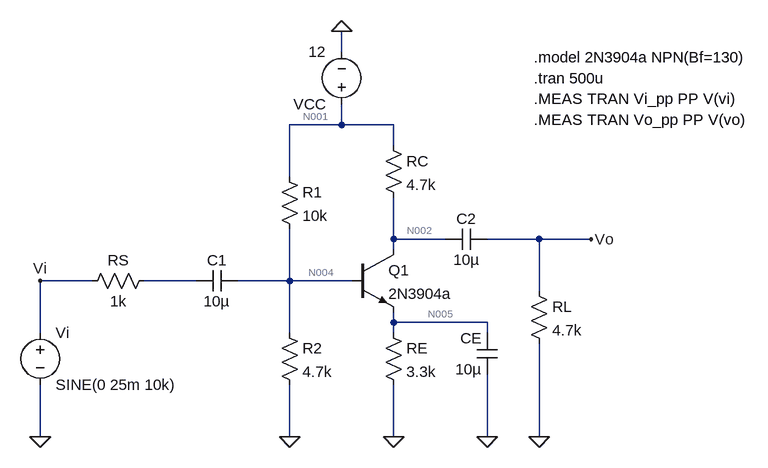
[diagram p0: schematic Circuito.asc]
Circuito.asc, the LTspice schematic file:
Version 4.1
SHEET 1 928 680
WIRE 272 -256 272 -288
WIRE 272 -144 272 -176
WIRE 272 -144 192 -144
WIRE 352 -144 272 -144
WIRE 352 -112 352 -144
WIRE 192 -64 192 -144
WIRE 352 32 352 -32
WIRE 432 32 352 32
WIRE 576 32 496 32
WIRE 656 32 576 32
WIRE 352 48 352 32
WIRE -112 96 -192 96
WIRE 48 96 -32 96
WIRE 192 96 192 16
WIRE 192 96 112 96
WIRE 288 96 192 96
WIRE 576 112 576 32
WIRE 352 160 352 144
WIRE 496 160 352 160
WIRE -192 176 -192 96
WIRE 192 176 192 96
WIRE 352 176 352 160
WIRE 496 176 496 160
WIRE -192 336 -192 256
WIRE 192 336 192 256
WIRE 352 336 352 256
WIRE 496 336 496 240
WIRE 576 336 576 192
FLAG -192 336 0
FLAG 192 336 0
FLAG 352 336 0
FLAG 496 336 0
FLAG 576 336 0
FLAG 272 -288 0
FLAG 656 32 Vo
FLAG -192 96 Vi
SYMBOL voltage 272 -160 R180
WINDOW 123 0 0 Left 0
WINDOW 39 0 0 Left 0
SYMATTR InstName VCC
SYMATTR Value 12
SYMBOL voltage -192 160 R0
WINDOW 123 0 0 Left 0
WINDOW 39 0 0 Left 0
SYMATTR InstName Vi
SYMATTR Value SINE(0 25m 10k)
SYMBOL res 176 -80 R0
SYMATTR InstName R1
SYMATTR Value 10k
SYMBOL res 176 160 R0
SYMATTR InstName R2
SYMATTR Value 4.7k
SYMBOL res 336 -128 R0
SYMATTR InstName RC
SYMATTR Value 4.7k
SYMBOL res 336 160 R0
SYMATTR InstName RE
SYMATTR Value 3.3k
SYMBOL res 560 96 R0
SYMATTR InstName RL
SYMATTR Value 4.7k
SYMBOL res -16 80 R90
WINDOW 0 0 56 VBottom 2
WINDOW 3 32 56 VTop 2
SYMATTR InstName RS
SYMATTR Value 1k
SYMBOL cap 112 80 R90
WINDOW 0 0 32 VBottom 2
WINDOW 3 32 32 VTop 2
SYMATTR InstName C1
SYMATTR Value 10µ
SYMBOL cap 512 240 R180
WINDOW 0 24 56 Left 2
WINDOW 3 24 8 Left 2
SYMATTR InstName CE
SYMATTR Value 10µ
SYMBOL cap 496 16 R90
WINDOW 0 0 32 VBottom 2
WINDOW 3 32 32 VTop 2
SYMATTR InstName C2
SYMATTR Value 10µ
SYMBOL npn 288 48 R0
SYMATTR InstName Q1
SYMATTR Value 2N3904a
TEXT 568 -248 Left 2 !.model 2N3904a NPN(Bf=130)
TEXT 568 -216 Left 2 !.tran 500u
TEXT 568 -184 Left 2 !.MEAS TRAN Vi_pp PP V(vi)
TEXT 568 -152 Left 2 !.MEAS TRAN Vo_pp PP V(vo)

The netlist it stands for:
* Circuito.asc
VCC N001 0 12
Vi Vi 0 SINE(0 25m 10k)
R1 N001 N004 10k
R2 N004 0 4.7k
RC N001 N002 4.7k
RE N005 0 3.3k
RL Vo 0 4.7k
RS N003 Vi 1k
C1 N004 N003 10µ
CE 0 N005 10µ
C2 Vo N002 10µ
Q1 N002 N004 N005 0 2N3904a
.model NPN NPN
.model PNP PNP
.lib standard.bjt
.model 2N3904a NPN(Bf=130)
.tran 500u
.MEAS TRAN Vi_pp PP V(vi)
.MEAS TRAN Vo_pp PP V(vo)
.backanno
.end

* Results of the author's LTspice run, read from the files saved beside the schematic
* Operating Point, zero values left out:
*   V(n001) = 12 V
*   V(n002) = 7.7 V
*   V(n004) = 3.814 V
*   V(n005) = 3.042 V
*   I(R1) = 818.6 µA
*   I(R2) = 811.5 µA
*   I(RC) = 914.9 µA
*   I(RE) = 921.9 µA
*   I(VCC) = -1.733 mA
*   Ib(Q1) = 7.037 µA
*   Ic(Q1) = 914.9 µA
*   Ie(Q1) = -921.9 µA
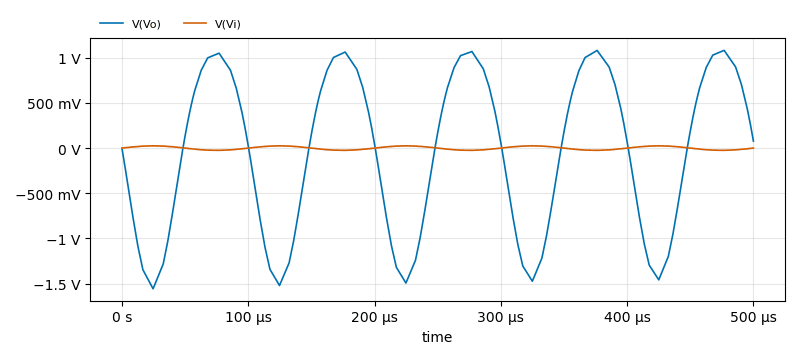
[diagram p1: Transient Analysis of Circuito.asc, plotted from the saved traces]
* Transient Analysis, 1 run:
*   V(Vo): min -1.559 V, max 1.083 V, average -52.46 mV, rms 906.1 mV, last 77.54 mV
*   V(Vi): min -24.91 mV, max 24.99 mV, average 57.59 µV, rms 17.45 mV, last 0 V
* From the log:
*   vi_pp: PP(V(vi))=0.049967645336 FROM 0 TO 0.0005
*   vo_pp: PP(V(vo))=2.65124972989 FROM 0 TO 0.0005